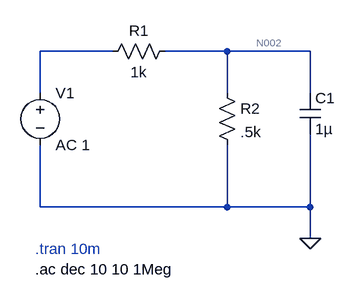
[diagram p0: schematic C_AC.asc]
C_AC.asc, the LTspice schematic file:
Version 4
SHEET 1 880 680
WIRE 128 128 16 128
WIRE 304 128 208 128
WIRE 432 128 304 128
WIRE 16 192 16 128
WIRE 304 192 304 128
WIRE 432 192 432 128
WIRE 16 368 16 272
WIRE 304 368 304 272
WIRE 304 368 16 368
WIRE 432 368 432 256
WIRE 432 368 304 368
WIRE 432 416 432 368
FLAG 432 416 0
SYMBOL res 224 112 R90
WINDOW 0 0 56 VBottom 2
WINDOW 3 32 56 VTop 2
SYMATTR InstName R1
SYMATTR Value 1k
SYMBOL res 288 176 R0
SYMATTR InstName R2
SYMATTR Value .5k
SYMBOL cap 416 192 R0
SYMATTR InstName C1
SYMATTR Value 1µ
SYMBOL voltage 16 176 R0
WINDOW 123 0 0 Left 0
WINDOW 39 0 0 Left 0
SYMATTR InstName V1
SYMATTR Value AC 1
TEXT 8 432 Left 2 ;.tran 10m
TEXT 8 464 Left 2 !.ac dec 10 10 1Meg

The netlist it stands for:
* C_AC.asc
R1 N002 N001 1k
R2 N002 0 .5k
C1 N002 0 1µ
V1 N001 0 AC 1
* .tran 10m
.ac dec 10 10 1Meg
.backanno
.end

* Results of the author's LTspice run, read from the files saved beside the schematic
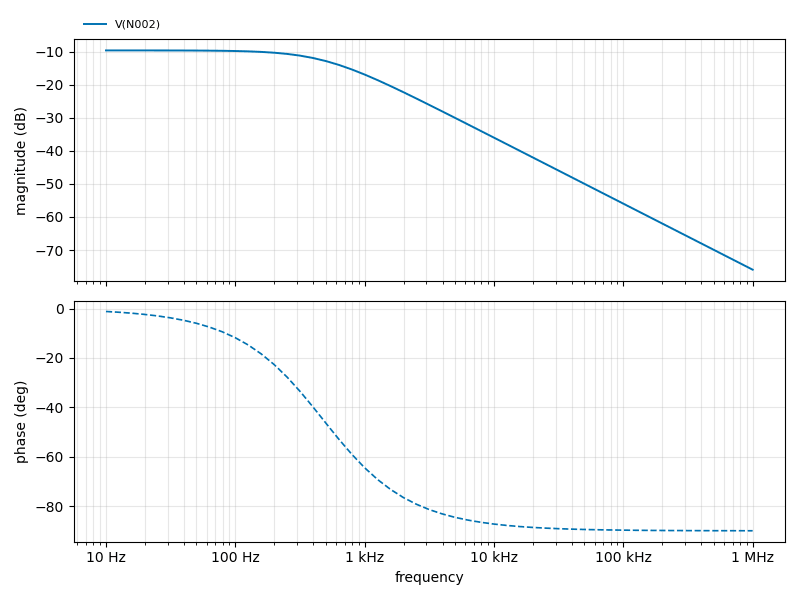
[diagram p1: AC Analysis of C_AC.asc, plotted from the saved traces]
* AC Analysis, 1 run:
*   V(N002): -9.54 dB at 10 Hz, -75.96 dB at 1 MHz, peak -9.54 dB at 10 Hz, 3 dB below the peak at 475.4 Hz